# EAGLE schematic cpu-68010 (EAGLE 9.2.1)

## Sheet 1 of 6: External bus connection, power
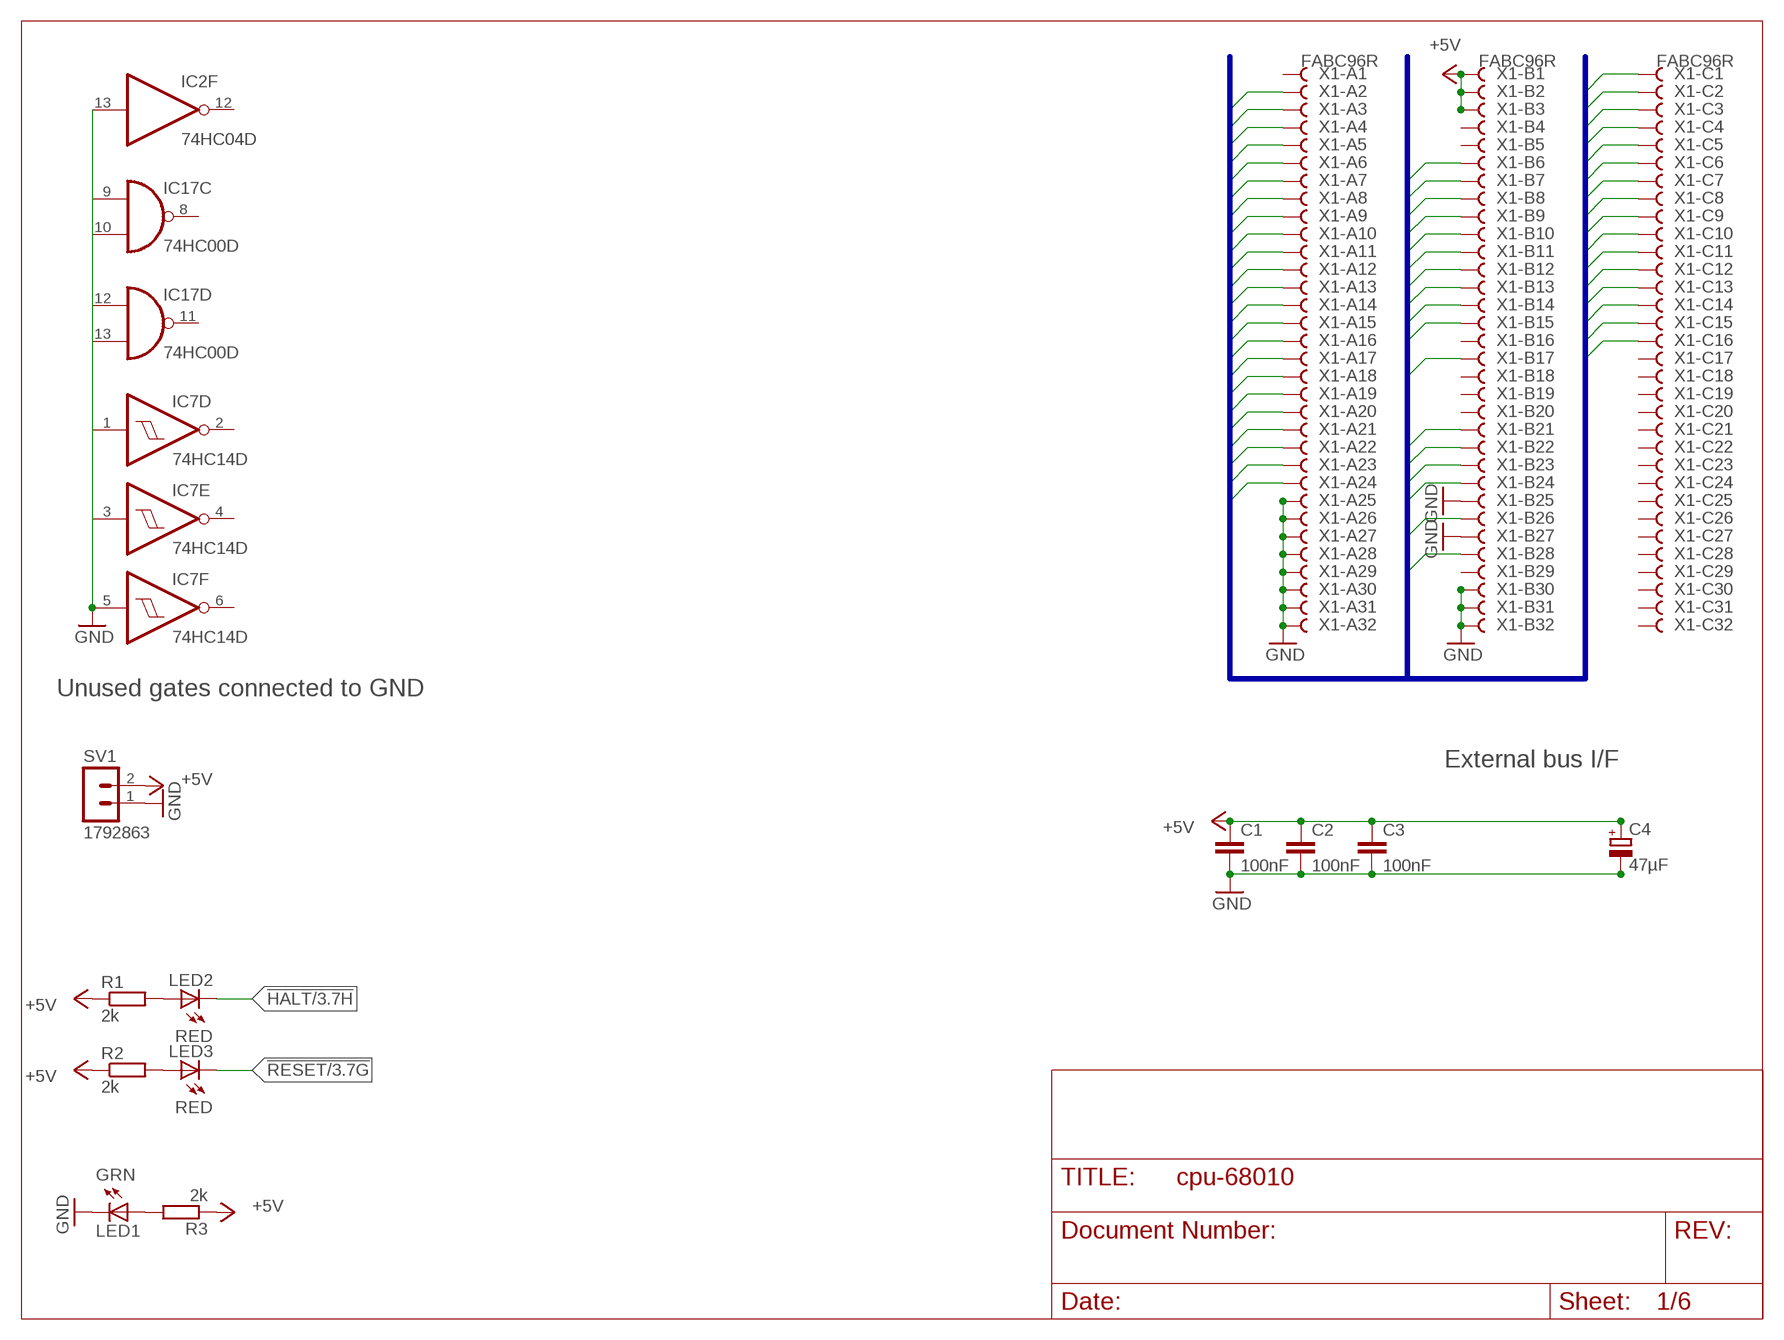
[diagram p0: schematic, sheet 1]

### Parts
C1  100nF  C-EUC0805  [C0805]
C2  100nF  C-EUC0805  [C0805]
C3  100nF  C-EUC0805  [C0805]
C4  47µF  CPOL-EUCT6032  [CT6032]
IC2  74HC04D  [SO14]
IC7  74HC14D  [SO14]
IC17  74HC00D  [SO14]
LED1  GRN  LEDCHIPLED_1206  [CHIPLED_1206]
LED2  RED  LEDCHIPLED_1206  [CHIPLED_1206]
LED3  RED  LEDCHIPLED_1206  [CHIPLED_1206]
R1  2k  R-EU_M0805  [M0805]
R2  2k  R-EU_M0805  [M0805]
R3  2k  R-EU_M0805  [M0805]
SV1  1792863  [1792863]
X1  FABC96R  [FABC96R]

### Nets
!AS: X1.B21 ; also sheet 2
!BERR: X1.B9 ; also sheet 2
!BG: X1.B14 ; also sheet 2
!BGACK: X1.B15 ; also sheet 2
!BR: X1.B13 ; also sheet 2
!EXT_DTACK: X1.B28 ; also sheet 3
!EXT_IRQ: X1.B17 ; also sheet 3
!HALT: LED2.C X1.B11 ; also sheet 2,3
!LDS: X1.B24 ; also sheet 2
!RESET: LED3.C X1.B10 ; also sheet 2,3,6
!UDS: X1.B23 ; also sheet 2
!VPA: X1.B12 ; also sheet 2,3
+5V: C1.1 C2.1 C3.1 C4.+ R1.1 R2.1 R3.1 SV1.2 X1.B1 X1.B2 X1.B3 ; also sheet 2,3,4,5,6
A1: X1.A2 ; also sheet 2,4,5,6
A2: X1.A3 ; also sheet 2,4,5,6
A3: X1.A4 ; also sheet 2,4,5,6
A4: X1.A5 ; also sheet 2,4,5,6
A5: X1.A6 ; also sheet 2,4,5,6
A6: X1.A7 ; also sheet 2,4,5,6
A7: X1.A8 ; also sheet 2,4,5,6
A8: X1.A9 ; also sheet 2,4,5,6
A9: X1.A10 ; also sheet 2,4,5,6
A10: X1.A11 ; also sheet 2,4,5,6
A11: X1.A12 ; also sheet 2,4,5,6
A12: X1.A13 ; also sheet 2,4,5,6
A13: X1.A14 ; also sheet 2,4,5,6
A14: X1.A15 ; also sheet 2,4,5,6
A15: X1.A16 ; also sheet 2,4,5,6
A16: X1.A17 ; also sheet 2,3,4,5
A17: X1.A18 ; also sheet 2,3,4,5
A18: X1.A19 ; also sheet 2,3,4,5
A19: X1.A20 ; also sheet 2,3,5,6
A20: X1.A21 ; also sheet 2
A21: X1.A22 ; also sheet 2
A22: X1.A23 ; also sheet 2
A23: X1.A24 ; also sheet 2
CLK: X1.B26 ; also sheet 2
D0: X1.C1 ; also sheet 2,4,5,6
D1: X1.C2 ; also sheet 2,4,5,6
D2: X1.C3 ; also sheet 2,4,5,6
D3: X1.C4 ; also sheet 2,4,5,6
D4: X1.C5 ; also sheet 2,4,5,6
D5: X1.C6 ; also sheet 2,4,5,6
D6: X1.C7 ; also sheet 2,4,5,6
D7: X1.C8 ; also sheet 2,4,5,6
D8: X1.C9 ; also sheet 2,4,5
D9: X1.C10 ; also sheet 2,4,5
D10: X1.C11 ; also sheet 2,4,5
D11: X1.C12 ; also sheet 2,4,5
D12: X1.C13 ; also sheet 2,4,5
D13: X1.C14 ; also sheet 2,4,5
D14: X1.C15 ; also sheet 2,4,5
D15: X1.C16 ; also sheet 2,4,5
FC0: X1.B6 ; also sheet 2,3
FC1: X1.B7 ; also sheet 2,3
FC2: X1.B8 ; also sheet 2,3
GND: C1.2 C2.2 C3.2 C4.- IC2.13(F:I) IC7.5(F:I) LED1.C SV1.1 X1.A25 X1.A26 X1.A27 X1.A28 X1.A29 X1.A30 X1.A31 X1.A32 X1.B25 X1.B27 X1.B30 X1.B31 X1.B32 ; also sheet 2,3,4,5,6
N$12: LED3.A R2.2
N$15: LED2.A R1.2
N$19: LED1.A R3.2
R!W!: X1.B22 ; also sheet 2
Unconnected: IC2.12(F:O) IC7.1(D:I) IC7.2(D:O) IC7.3(E:I) IC7.4(E:O) IC7.6(F:O) IC17.8(C:O) IC17.9(C:I0) IC17.10(C:I1) IC17.11(D:O) IC17.12(D:I0) IC17.13(D:I1) X1.A1 X1.B4 X1.B5 X1.B16 X1.B18 X1.B19 X1.B20 X1.B29 X1.C17 X1.C18 X1.C19 X1.C20 X1.C21 X1.C22 X1.C23 X1.C24 X1.C25 X1.C26 X1.C27 X1.C28 X1.C29 X1.C30 X1.C31 X1.C32

### Buses
A[1..23],!AS,!BERR,!BG,!BGACK,!BR,CLK,D[0..15],E,!EXT_DTACK,!EXT_IRQ,FC[0..2],!HALT,!IPL[0..2],!LDS,R!W!,!UDS,!VMA,!VPA

### Notes on the sheet
- Unused gates connected to GND
- External bus I/F

## Sheet 2 of 6: CPU, address decoding
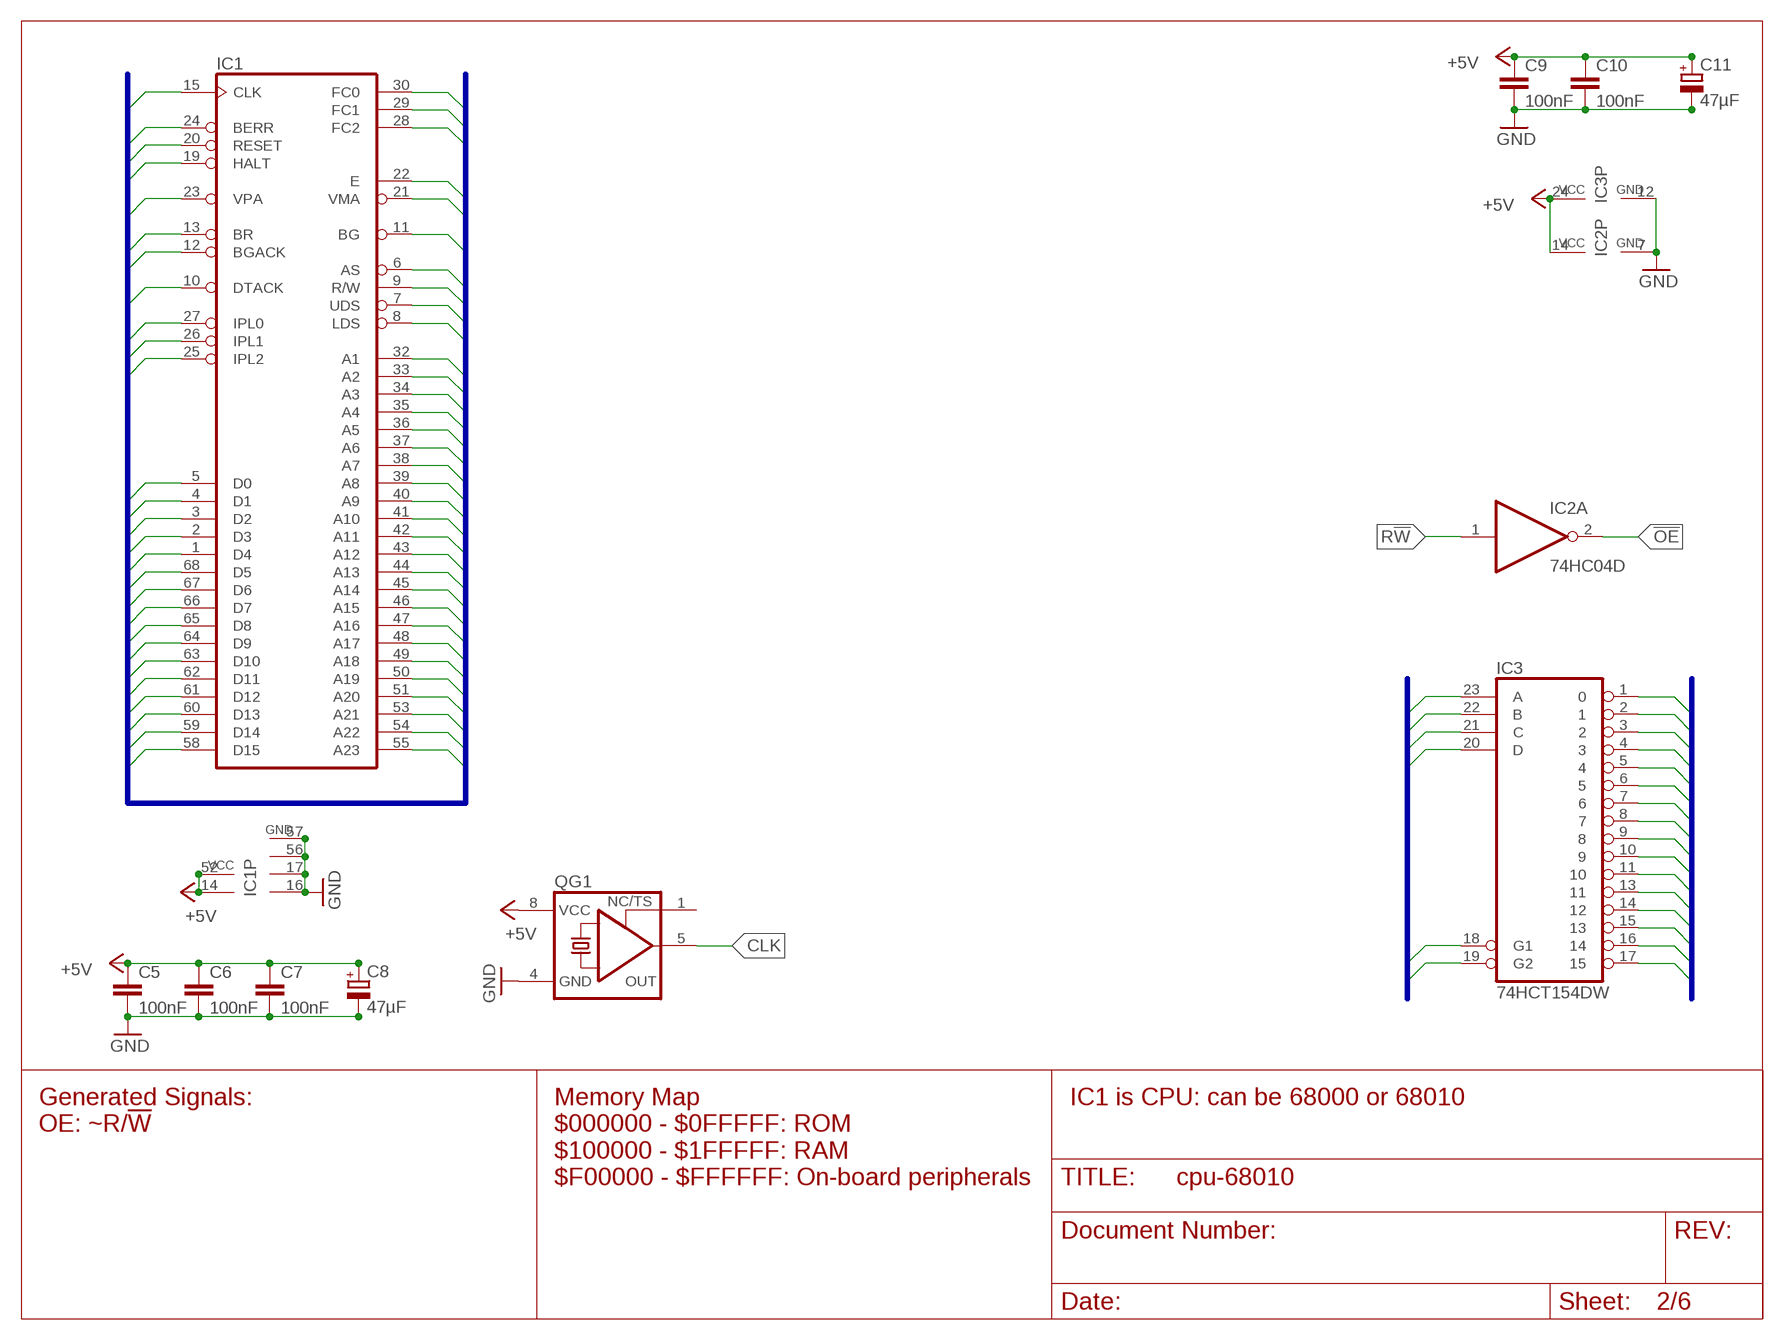
[diagram p1: schematic, sheet 2]

### Parts
C5  100nF  C-EUC0805  [C0805]
C6  100nF  C-EUC0805  [C0805]
C7  100nF  C-EUC0805  [C0805]
C8  47µF  CPOL-EUCT6032  [CT6032]
C9  100nF  C-EUC0805  [C0805]
C10  100nF  C-EUC0805  [C0805]
C11  47µF  CPOL-EUCT6032  [CT6032]
IC1  MC68000FN-SOC  [PLCC68SOCK]
IC3  74HCT154DW  [SO24W]
QG1  XO-8  [DIL08S]

### Nets
!AS: IC1.6(AS) ; also sheet 1
!BERR: IC1.24(BERR) ; also sheet 1
!BG: IC1.11(BG) ; also sheet 1
!BGACK: IC1.12(BGACK) ; also sheet 1
!BR: IC1.13(BR) ; also sheet 1
!DTACK: IC1.10(DTACK) ; also sheet 3
!HALT: IC1.19(HALT) ; also sheet 1,3
!IPL0: IC1.27(IPL0) ; also sheet 3
!IPL1: IC1.26(IPL1) ; also sheet 3
!IPL2: IC1.25(IPL2) ; also sheet 3
!LDS: IC1.8(LDS) ; also sheet 1
!OE: IC2.2(A:O) ; also sheet 4,5,6
!REGION0: IC3.1 ; also sheet 3,5
!REGION1: IC3.2 ; also sheet 3,4
!REGION2: IC3.3
!REGION3: IC3.4
!REGION4: IC3.5
!REGION5: IC3.6
!REGION6: IC3.7
!REGION7: IC3.8
!REGION8: IC3.9
!REGION9: IC3.10
!REGION10: IC3.11
!REGION11: IC3.13
!REGION12: IC3.14
!REGION13: IC3.15
!REGION14: IC3.16
!REGION15: IC3.17 ; also sheet 6
!RESET: IC1.20(RESET) ; also sheet 1,3,6
!UDS: IC1.7(UDS) ; also sheet 1
!VMA: IC1.21(VMA)
!VPA: IC1.23(VPA) ; also sheet 1,3
+5V: C5.1 C6.1 C7.1 C8.+ C9.1 C10.1 C11.+ IC1.14(VCC) IC1.52(VCC) IC2.14(P:VCC) IC3.24(VCC) QG1.8(VCC) ; also sheet 1,3,4,5,6
/AS: IC3.18(G1) IC3.19(G2)
A1: IC1.32(A1) ; also sheet 1,4,5,6
A2: IC1.33(A2) ; also sheet 1,4,5,6
A3: IC1.34(A3) ; also sheet 1,4,5,6
A4: IC1.35(A4) ; also sheet 1,4,5,6
A5: IC1.36(A5) ; also sheet 1,4,5,6
A6: IC1.37(A6) ; also sheet 1,4,5,6
A7: IC1.38(A7) ; also sheet 1,4,5,6
A8: IC1.39(A8) ; also sheet 1,4,5,6
A9: IC1.40(A9) ; also sheet 1,4,5,6
A10: IC1.41(A10) ; also sheet 1,4,5,6
A11: IC1.42(A11) ; also sheet 1,4,5,6
A12: IC1.43(A12) ; also sheet 1,4,5,6
A13: IC1.44(A13) ; also sheet 1,4,5,6
A14: IC1.45(A14) ; also sheet 1,4,5,6
A15: IC1.46(A15) ; also sheet 1,4,5,6
A16: IC1.47(A16) ; also sheet 1,3,4,5
A17: IC1.48(A17) ; also sheet 1,3,4,5
A18: IC1.49(A18) ; also sheet 1,3,4,5
A19: IC1.50(A19) ; also sheet 1,3,5,6
A20: IC1.51(A20) IC3.23(A) ; also sheet 1
A21: IC1.53(A21) IC3.22(B) ; also sheet 1
A22: IC1.54(A22) IC3.21(C) ; also sheet 1
A23: IC1.55(A23) IC3.20(D) ; also sheet 1
CLK: IC1.15(CLK) QG1.5(OUT) ; also sheet 1
D0: IC1.5(D0) ; also sheet 1,4,5,6
D1: IC1.4(D1) ; also sheet 1,4,5,6
D2: IC1.3(D2) ; also sheet 1,4,5,6
D3: IC1.2(D3) ; also sheet 1,4,5,6
D4: IC1.1(D4) ; also sheet 1,4,5,6
D5: IC1.68(D5) ; also sheet 1,4,5,6
D6: IC1.67(D6) ; also sheet 1,4,5,6
D7: IC1.66(D7) ; also sheet 1,4,5,6
D8: IC1.65(D8) ; also sheet 1,4,5
D9: IC1.64(D9) ; also sheet 1,4,5
D10: IC1.63(D10) ; also sheet 1,4,5
D11: IC1.62(D11) ; also sheet 1,4,5
D12: IC1.61(D12) ; also sheet 1,4,5
D13: IC1.60(D13) ; also sheet 1,4,5
D14: IC1.59(D14) ; also sheet 1,4,5
D15: IC1.58(D15) ; also sheet 1,4,5
E: IC1.22(E)
FC0: IC1.30(FC0) ; also sheet 1,3
FC1: IC1.29(FC1) ; also sheet 1,3
FC2: IC1.28(FC2) ; also sheet 1,3
GND: C5.2 C6.2 C7.2 C8.- C9.2 C10.2 C11.- IC1.16(GND) IC1.17(GND) IC1.56(GND) IC1.57(GND) IC2.7(P:GND) IC3.12(GND) QG1.4(GND) ; also sheet 1,3,4,5,6
R!W!: IC1.9(R/W) IC2.1(A:I) ; also sheet 1
Unconnected: QG1.1(TS)

### Buses
A[1..23],!AS,!BERR,!BG,!BGACK,!BR,CLK,D[0..15],!DTACK,E,FC[0..2],!HALT,!IPL[0..2],!LDS,R!W!,!UDS,!VMA,!VPA
A[20..23],/AS
!REGION[0..15]

### Notes on the sheet
- Generated Signals:
  OE: ~R/!W
- Memory Map
  $000000 - $0FFFFF: ROM
  $100000 - $1FFFFF: RAM
  $F00000 - $FFFFFF: On-board peripherals
- IC1 is CPU: can be 68000 or 68010

## Sheet 3 of 6: DTACK and Interrupts
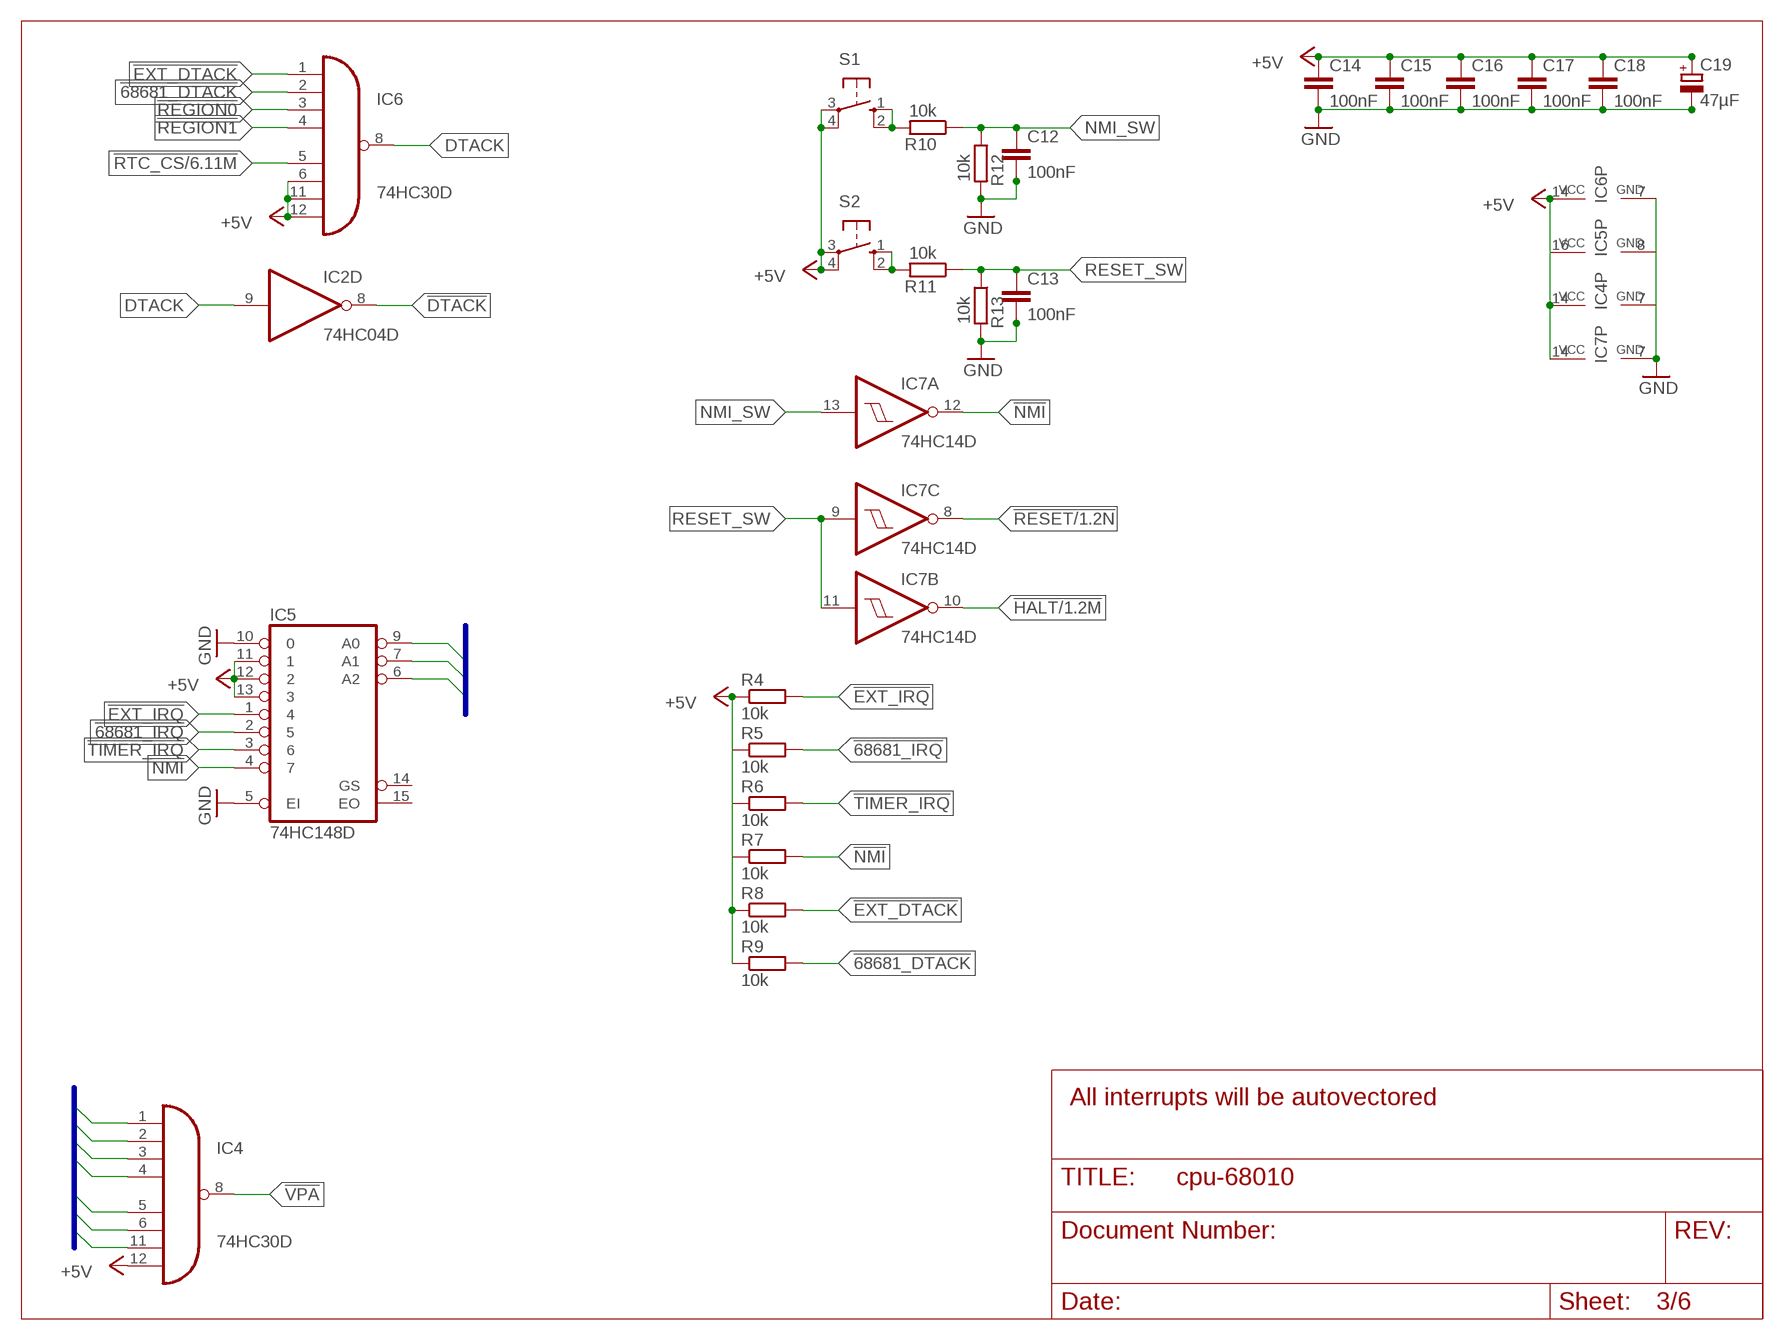
[diagram p2: schematic, sheet 3]

### Parts
C12  100nF  C-EUC0805  [C0805]
C13  100nF  C-EUC0805  [C0805]
C14  100nF  C-EUC0805  [C0805]
C15  100nF  C-EUC0805  [C0805]
C16  100nF  C-EUC0805  [C0805]
C17  100nF  C-EUC0805  [C0805]
C18  100nF  C-EUC0805  [C0805]
C19  47µF  CPOL-EUCT6032  [CT6032]
IC4  74HC30D  [SO14]
IC5  74HC148D  [SO16]
IC6  74HC30D  [SO14]
R4  10k  R-EU_M0805  [M0805]
R5  10k  R-EU_M0805  [M0805]
R6  10k  R-EU_M0805  [M0805]
R7  10k  R-EU_M0805  [M0805]
R8  10k  R-EU_M0805  [M0805]
R9  10k  R-EU_M0805  [M0805]
R10  10k  R-EU_M0805  [M0805]
R11  10k  R-EU_M0805  [M0805]
R12  10k  R-EU_M0805  [M0805]
R13  10k  R-EU_M0805  [M0805]
S1  10-XX  [B3F-10XX]
S2  10-XX  [B3F-10XX]

### Nets
!68681_DTACK: IC6.2(I1) R9.2 ; also sheet 6
!68681_IRQ: IC5.2 R5.2 ; also sheet 6
!DTACK: IC2.8(D:O) ; also sheet 2
!EXT_DTACK: IC6.1(I0) R8.2 ; also sheet 1
!EXT_IRQ: IC5.1 R4.2 ; also sheet 1
!HALT: IC7.10(B:O) ; also sheet 1,2
!IPL0: IC5.9(A0) ; also sheet 2
!IPL1: IC5.7(A1) ; also sheet 2
!IPL2: IC5.6(A2) ; also sheet 2
!NMI: IC5.4 IC7.12(A:O) R7.2
!REGION0: IC6.3(I2) ; also sheet 2,5
!REGION1: IC6.4(I3) ; also sheet 2,4
!RESET: IC7.8(C:O) ; also sheet 1,2,6
!RTC_CS: IC6.5(I4) ; also sheet 6
!TIMER_IRQ: IC5.3 R6.2
!VPA: IC4.8(O) ; also sheet 1,2
+5V: C14.1 C15.1 C16.1 C17.1 C18.1 C19.+ IC4.12(I7) IC4.14(VCC) IC5.11 IC5.12 IC5.13 IC5.16(VCC) IC6.6(I5) IC6.11(I6) IC6.12(I7) IC6.14(VCC) IC7.14(P:VCC) R4.1 R8.1 R9.1 S1.3(P) S1.4(P1) S2.3(P) S2.4(P1) ; also sheet 1,2,4,5,6
A16: IC4.4(I3) ; also sheet 1,2,4,5
A17: IC4.5(I4) ; also sheet 1,2,4,5
A18: IC4.6(I5) ; also sheet 1,2,4,5
A19: IC4.11(I6) ; also sheet 1,2,5,6
DTACK: IC2.9(D:I) IC6.8(O)
FC0: IC4.1(I0) ; also sheet 1,2
FC1: IC4.2(I1) ; also sheet 1,2
FC2: IC4.3(I2) ; also sheet 1,2
GND: C12.2 C13.2 C14.2 C15.2 C16.2 C17.2 C18.2 C19.- IC4.7(GND) IC5.5(EI) IC5.8(GND) IC5.10 IC6.7(GND) IC7.7(P:GND) R12.2 R13.2 ; also sheet 1,2,4,5,6
N$9: R11.2 S2.1(S) S2.2(S1)
N$18: R10.2 S1.1(S) S1.2(S1)
NMI_SW: C12.1 IC7.13(A:I) R10.1 R12.1
RESET_SW: C13.1 IC7.9(C:I) IC7.11(B:I) R11.1 R13.1
Unconnected: IC5.14(GS) IC5.15(EO) R5.1 R6.1 R7.1

### Buses
!IPL[0..2]
A[16..19],FC[0..2]

### Notes on the sheet
- All interrupts will be autovectored

## Sheet 4 of 6: Internal RAM
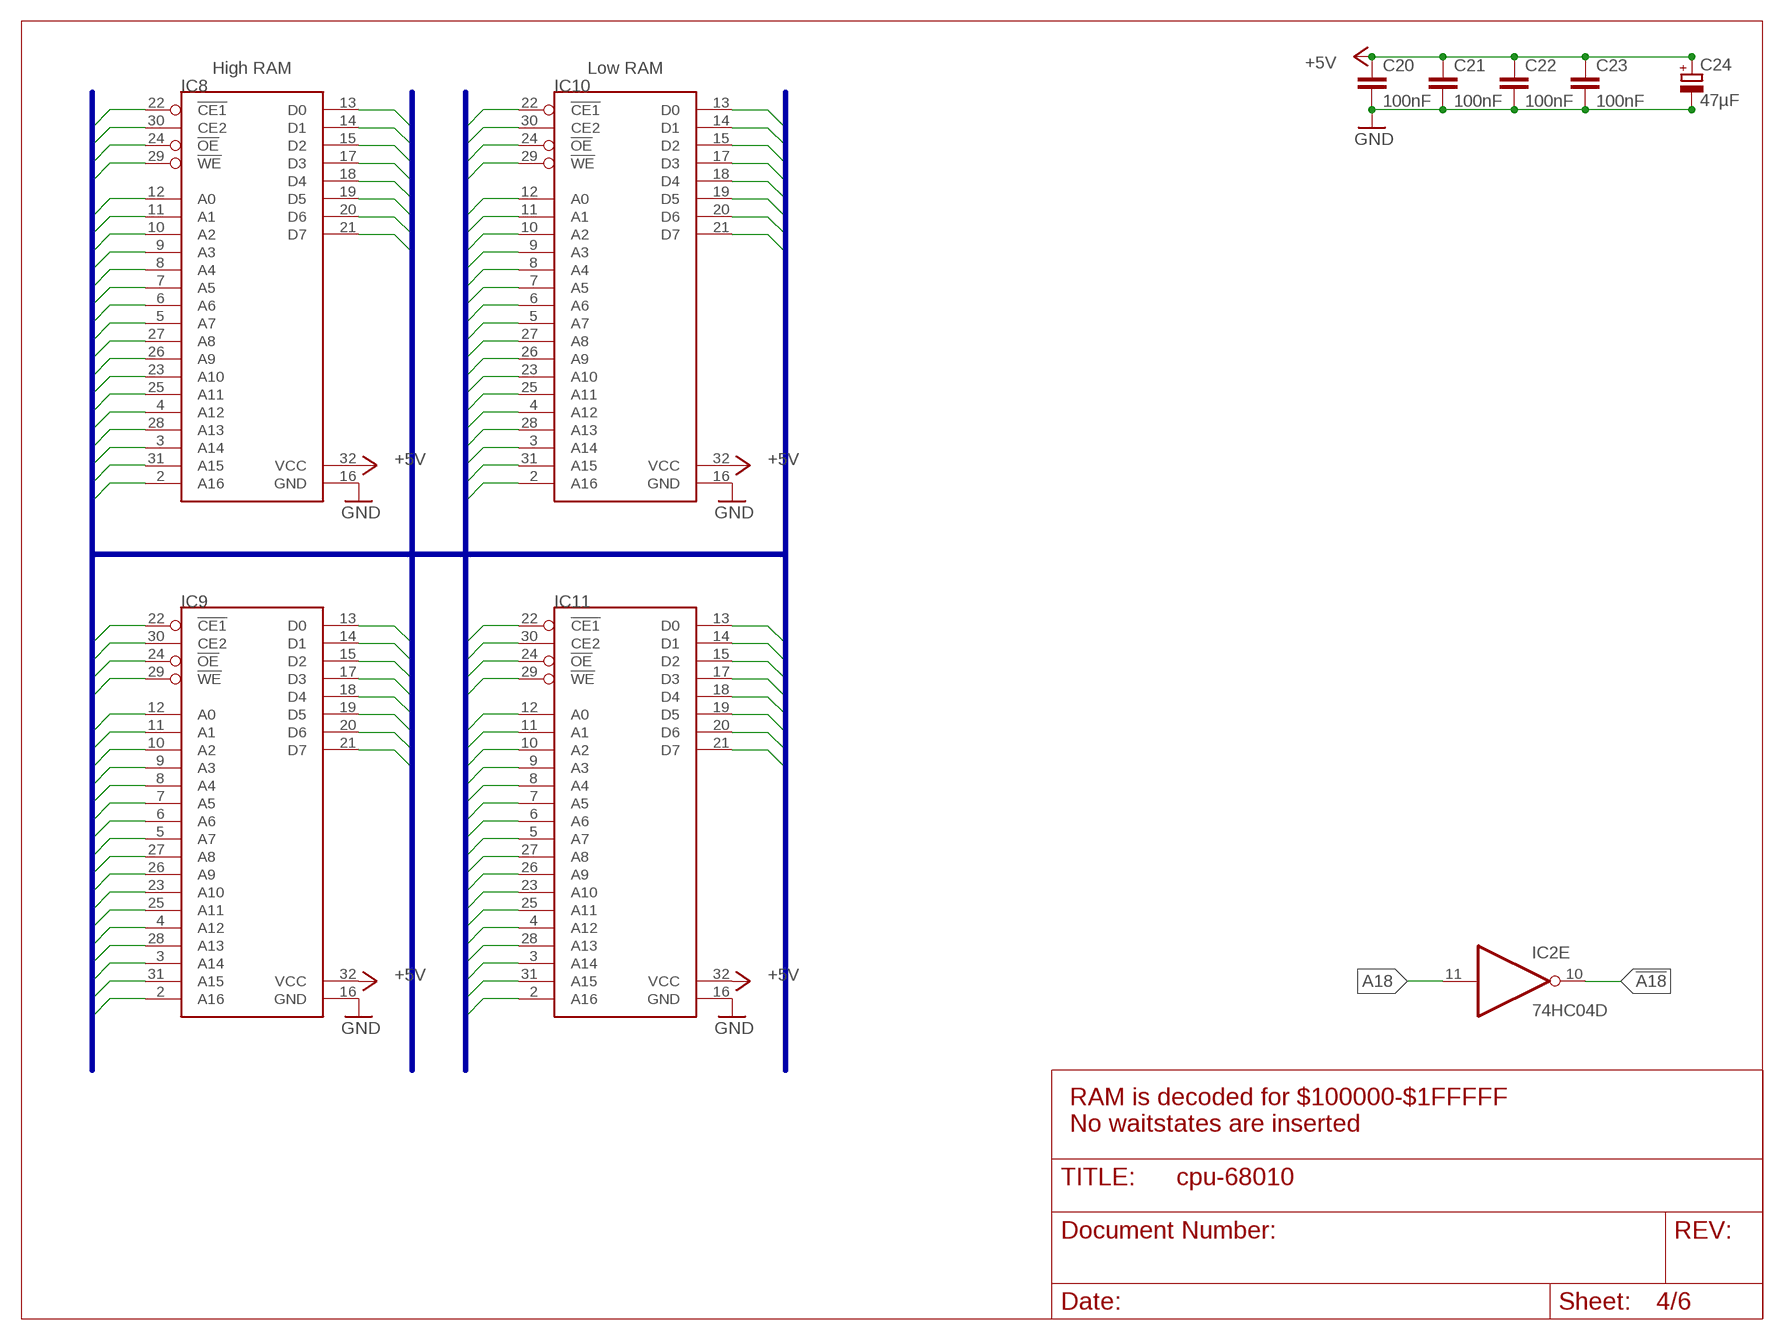
[diagram p3: schematic, sheet 4]

### Parts
C20  100nF  C-EUC0805  [C0805]
C21  100nF  C-EUC0805  [C0805]
C22  100nF  C-EUC0805  [C0805]
C23  100nF  C-EUC0805  [C0805]
C24  47µF  CPOL-EUCT6032  [CT6032]
IC8  CY62128BSOIC32  [SO32X]
IC9  CY62128BSOIC32  [SO32X]
IC10  CY62128BSOIC32  [SO32X]
IC11  CY62128BSOIC32  [SO32X]

### Nets
!A18: IC2.10(E:O) IC8.30(CE2) IC9.30(CE2) IC10.30(CE2) IC11.30(CE2)
!OE: IC8.24(!OE) IC9.24(!OE) IC10.24(!OE) IC11.24(!OE) ; also sheet 2,5,6
!REGION1: IC8.22(!CE1) IC9.22(!CE1) IC10.22(!CE1) IC11.22(!CE1) ; also sheet 2,3
+5V: C20.1 C21.1 C22.1 C23.1 C24.+ IC8.32(VCC) IC9.32(VCC) IC10.32(VCC) IC11.32(VCC) ; also sheet 1,2,3,5,6
A1: IC8.12(A0) IC9.12(A0) IC10.12(A0) IC11.12(A0) ; also sheet 1,2,5,6
A2: IC8.11(A1) IC9.11(A1) IC10.11(A1) IC11.11(A1) ; also sheet 1,2,5,6
A3: IC8.10(A2) IC9.10(A2) IC10.10(A2) IC11.10(A2) ; also sheet 1,2,5,6
A4: IC8.9(A3) IC9.9(A3) IC10.9(A3) IC11.9(A3) ; also sheet 1,2,5,6
A5: IC8.8(A4) IC9.8(A4) IC10.8(A4) IC11.8(A4) ; also sheet 1,2,5,6
A6: IC8.7(A5) IC9.7(A5) IC10.7(A5) IC11.7(A5) ; also sheet 1,2,5,6
A7: IC8.6(A6) IC9.6(A6) IC10.6(A6) IC11.6(A6) ; also sheet 1,2,5,6
A8: IC8.5(A7) IC9.5(A7) IC10.5(A7) IC11.5(A7) ; also sheet 1,2,5,6
A9: IC8.27(A8) IC9.27(A8) IC10.27(A8) IC11.27(A8) ; also sheet 1,2,5,6
A10: IC8.26(A9) IC9.26(A9) IC10.26(A9) IC11.26(A9) ; also sheet 1,2,5,6
A11: IC8.23(A10) IC9.23(A10) IC10.23(A10) IC11.23(A10) ; also sheet 1,2,5,6
A12: IC8.25(A11) IC9.25(A11) IC10.25(A11) IC11.25(A11) ; also sheet 1,2,5,6
A13: IC8.4(A12) IC9.4(A12) IC10.4(A12) IC11.4(A12) ; also sheet 1,2,5,6
A14: IC8.28(A13) IC9.28(A13) IC10.28(A13) IC11.28(A13) ; also sheet 1,2,5,6
A15: IC8.3(A14) IC9.3(A14) IC10.3(A14) IC11.3(A14) ; also sheet 1,2,5,6
A16: IC8.31(A15) IC9.31(A15) IC10.31(A15) IC11.31(A15) ; also sheet 1,2,3,5
A17: IC8.2(A16) IC9.2(A16) IC10.2(A16) IC11.2(A16) ; also sheet 1,2,3,5
A18: IC2.11(E:I) ; also sheet 1,2,3,5
D0: IC10.13(D0) IC11.13(D0) ; also sheet 1,2,5,6
D1: IC10.14(D1) IC11.14(D1) ; also sheet 1,2,5,6
D2: IC10.15(D2) IC11.15(D2) ; also sheet 1,2,5,6
D3: IC10.17(D3) IC11.17(D3) ; also sheet 1,2,5,6
D4: IC10.18(D4) IC11.18(D4) ; also sheet 1,2,5,6
D5: IC10.19(D5) IC11.19(D5) ; also sheet 1,2,5,6
D6: IC10.20(D6) IC11.20(D6) ; also sheet 1,2,5,6
D7: IC10.21(D7) IC11.21(D7) ; also sheet 1,2,5,6
D8: IC8.13(D0) IC9.13(D0) ; also sheet 1,2,5
D9: IC8.14(D1) IC9.14(D1) ; also sheet 1,2,5
D10: IC8.15(D2) IC9.15(D2) ; also sheet 1,2,5
D11: IC8.17(D3) IC9.17(D3) ; also sheet 1,2,5
D12: IC8.18(D4) IC9.18(D4) ; also sheet 1,2,5
D13: IC8.19(D5) IC9.19(D5) ; also sheet 1,2,5
D14: IC8.20(D6) IC9.20(D6) ; also sheet 1,2,5
D15: IC8.21(D7) IC9.21(D7) ; also sheet 1,2,5
GND: C20.2 C21.2 C22.2 C23.2 C24.- IC8.16(GND) IC9.16(GND) IC10.16(GND) IC11.16(GND) ; also sheet 1,2,3,5,6
R/!W!: IC8.29(!WE) IC9.29(!WE) IC10.29(!WE) IC11.29(!WE) ; also sheet 5,6

### Buses
A[1..23],!A18,D[0..15],!OE,!REGION1,R/!W!

### Notes on the sheet
- High RAM | Low RAM
- RAM is decoded for $100000-$1FFFFF
  No waitstates are inserted

## Sheet 5 of 6: System ROMs
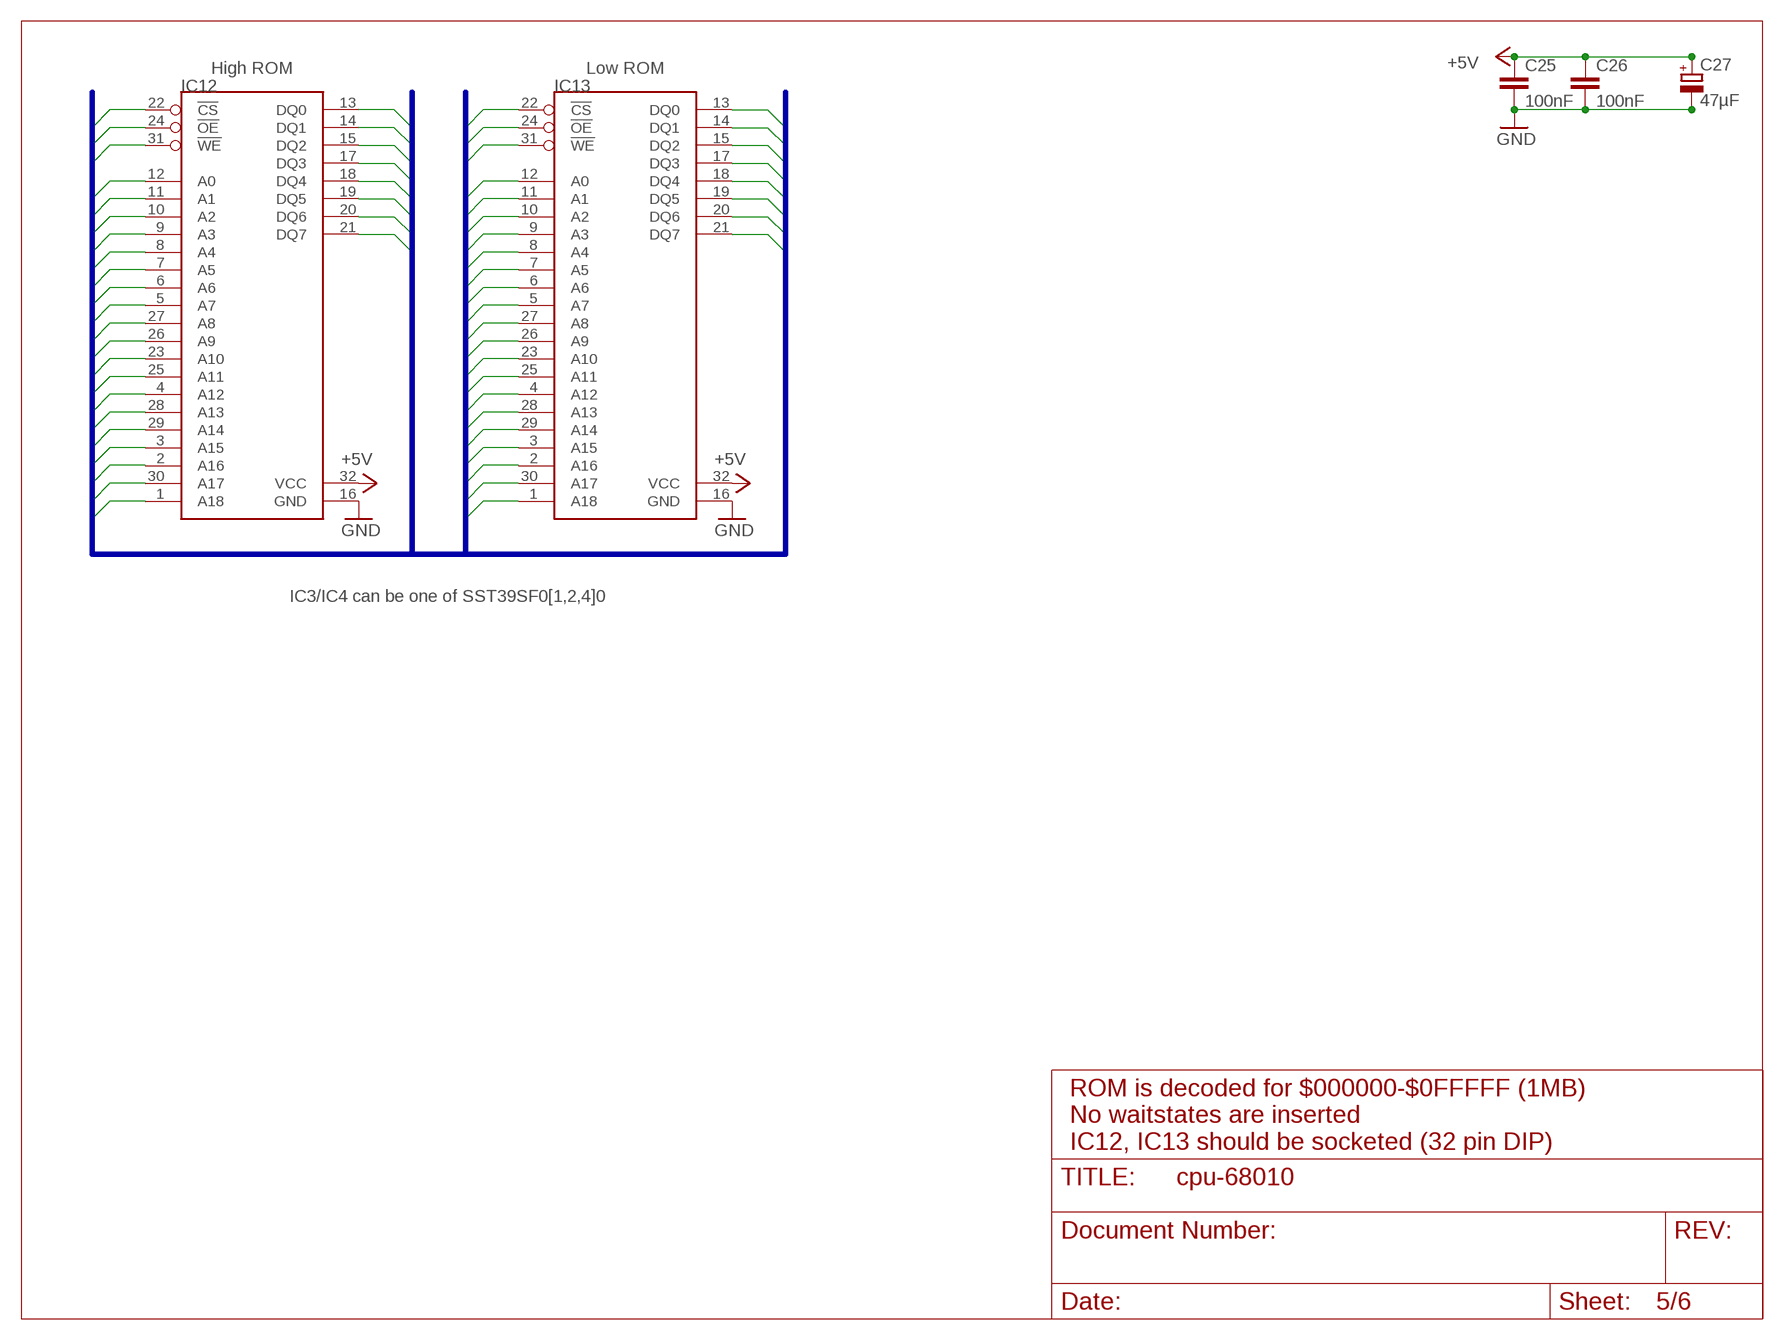
[diagram p4: schematic, sheet 5]

### Parts
C25  100nF  C-EUC0805  [C0805]
C26  100nF  C-EUC0805  [C0805]
C27  47µF  CPOL-EUCT6032  [CT6032]
IC12  SST39SF0X0PDIP32  [DIL32]
IC13  SST39SF0X0PDIP32  [DIL32]

### Nets
!OE: IC12.24(!OE) IC13.24(!OE) ; also sheet 2,4,6
!REGION0: IC12.22(!CS) IC13.22(!CS) ; also sheet 2,3
+5V: C25.1 C26.1 C27.+ IC12.32(VCC) IC13.32(VCC) ; also sheet 1,2,3,4,6
A1: IC12.12(A0) IC13.12(A0) ; also sheet 1,2,4,6
A2: IC12.11(A1) IC13.11(A1) ; also sheet 1,2,4,6
A3: IC12.10(A2) IC13.10(A2) ; also sheet 1,2,4,6
A4: IC12.9(A3) IC13.9(A3) ; also sheet 1,2,4,6
A5: IC12.8(A4) IC13.8(A4) ; also sheet 1,2,4,6
A6: IC12.7(A5) IC13.7(A5) ; also sheet 1,2,4,6
A7: IC12.6(A6) IC13.6(A6) ; also sheet 1,2,4,6
A8: IC12.5(A7) IC13.5(A7) ; also sheet 1,2,4,6
A9: IC12.27(A8) IC13.27(A8) ; also sheet 1,2,4,6
A10: IC12.26(A9) IC13.26(A9) ; also sheet 1,2,4,6
A11: IC12.23(A10) IC13.23(A10) ; also sheet 1,2,4,6
A12: IC12.25(A11) IC13.25(A11) ; also sheet 1,2,4,6
A13: IC12.4(A12) IC13.4(A12) ; also sheet 1,2,4,6
A14: IC12.28(A13) IC13.28(A13) ; also sheet 1,2,4,6
A15: IC12.29(A14) IC13.29(A14) ; also sheet 1,2,4,6
A16: IC12.3(A15) IC13.3(A15) ; also sheet 1,2,3,4
A17: IC12.2(A16) IC13.2(A16) ; also sheet 1,2,3,4
A18: IC12.30(A17) IC13.30(A17) ; also sheet 1,2,3,4
A19: IC12.1(A18) IC13.1(A18) ; also sheet 1,2,3,6
D0: IC13.13(DQ0) ; also sheet 1,2,4,6
D1: IC13.14(DQ1) ; also sheet 1,2,4,6
D2: IC13.15(DQ2) ; also sheet 1,2,4,6
D3: IC13.17(DQ3) ; also sheet 1,2,4,6
D4: IC13.18(DQ4) ; also sheet 1,2,4,6
D5: IC13.19(DQ5) ; also sheet 1,2,4,6
D6: IC13.20(DQ6) ; also sheet 1,2,4,6
D7: IC13.21(DQ7) ; also sheet 1,2,4,6
D8: IC12.13(DQ0) ; also sheet 1,2,4
D9: IC12.14(DQ1) ; also sheet 1,2,4
D10: IC12.15(DQ2) ; also sheet 1,2,4
D11: IC12.17(DQ3) ; also sheet 1,2,4
D12: IC12.18(DQ4) ; also sheet 1,2,4
D13: IC12.19(DQ5) ; also sheet 1,2,4
D14: IC12.20(DQ6) ; also sheet 1,2,4
D15: IC12.21(DQ7) ; also sheet 1,2,4
GND: C25.2 C26.2 C27.- IC12.16(GND) IC13.16(GND) ; also sheet 1,2,3,4,6
R/!W!: IC12.31(!WE) IC13.31(!WE) ; also sheet 4,6

### Buses
A[1..23],D[0..15],!OE,!REGION0,R/!W!

### Notes on the sheet
- High ROM | Low ROM
- IC3/IC4 can be one of SST39SF0[1,2,4]0
- ROM is decoded for $000000-$0FFFFF (1MB)
  No waitstates are inserted
  IC12, IC13 should be socketed (32 pin DIP)

## Sheet 6 of 6: Peripherals
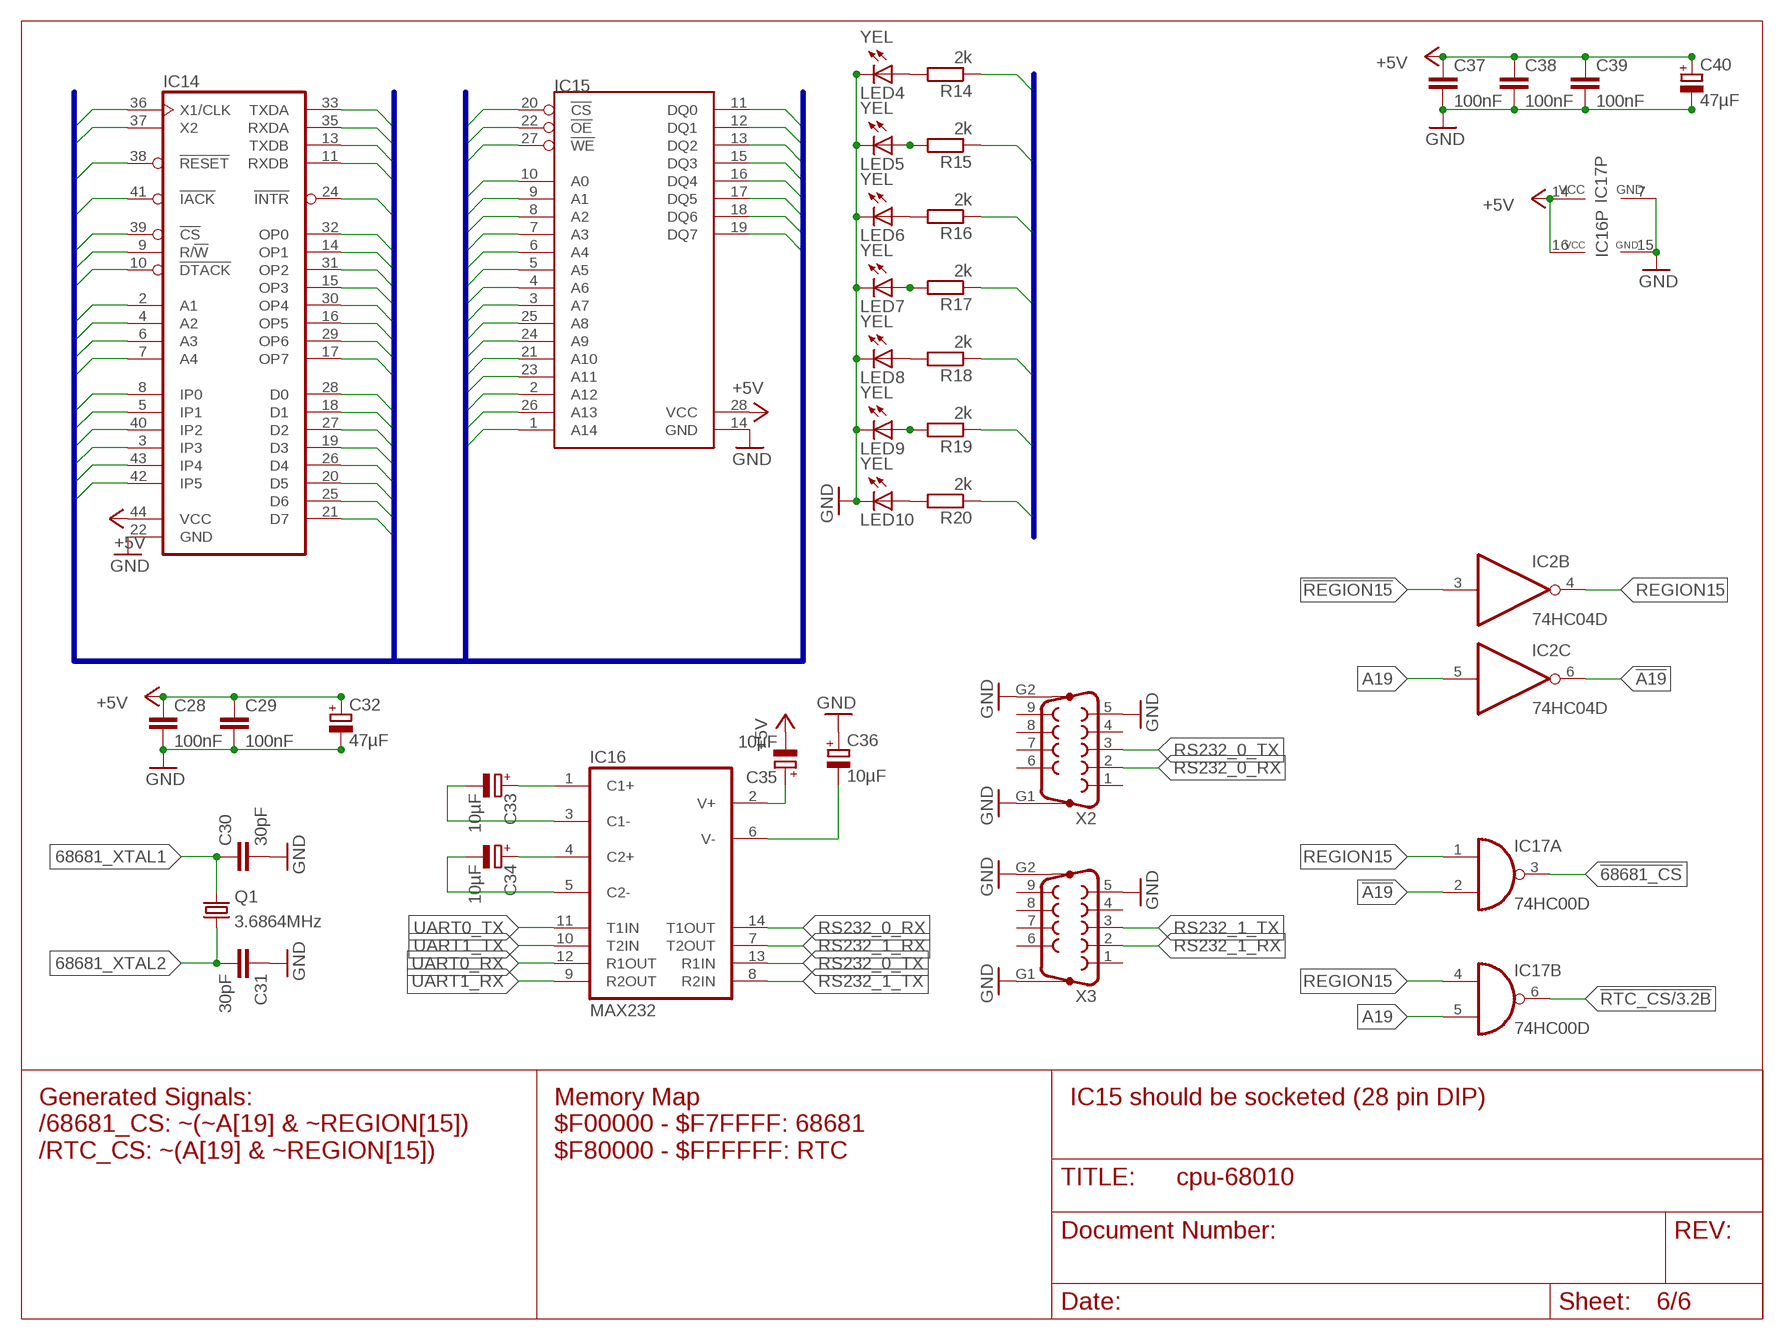
[diagram p5: schematic, sheet 6]

### Parts
C28  100nF  C-EUC0805  [C0805]
C29  100nF  C-EUC0805  [C0805]
C30  30pF  C-EUC0805  [C0805]
C31  30pF  C-EUC0805  [C0805]
C32  47µF  CPOL-EUCT6032  [CT6032]
C33  10µF  CPOL-EUE1.8-4  [E1,8-4]
C34  10µF  CPOL-EUE1.8-4  [E1,8-4]
C35  10µF  CPOL-EUE1.8-4  [E1,8-4]
C36  10µF  CPOL-EUE1.8-4  [E1,8-4]
C37  100nF  C-EUC0805  [C0805]
C38  100nF  C-EUC0805  [C0805]
C39  100nF  C-EUC0805  [C0805]
C40  47µF  CPOL-EUCT6032  [CT6032]
IC14  MC68681PLCC44-SOCKET  [PLCC-S44]
IC15  DS1244EDIP-28  [DIL28-6]
IC16  MAX232  [DIL16]
LED4  YEL  LEDCHIPLED_1206  [CHIPLED_1206]
LED5  YEL  LEDCHIPLED_1206  [CHIPLED_1206]
LED6  YEL  LEDCHIPLED_1206  [CHIPLED_1206]
LED7  YEL  LEDCHIPLED_1206  [CHIPLED_1206]
LED8  YEL  LEDCHIPLED_1206  [CHIPLED_1206]
LED9  YEL  LEDCHIPLED_1206  [CHIPLED_1206]
LED10  YEL  LEDCHIPLED_1206  [CHIPLED_1206]
Q1  3.6864MHz  CRYSTALHC49S  [HC49/S]
R14  2k  R-EU_M0805  [M0805]
R15  2k  R-EU_M0805  [M0805]
R16  2k  R-EU_M0805  [M0805]
R17  2k  R-EU_M0805  [M0805]
R18  2k  R-EU_M0805  [M0805]
R19  2k  R-EU_M0805  [M0805]
R20  2k  R-EU_M0805  [M0805]
X2  F09HP  [F09HP]
X3  F09HP  [F09HP]

### Nets
68681_XTAL1: C30.1 IC14.36(X1/CLK) Q1.2
68681_XTAL2: C31.2 IC14.37(X2) Q1.1
!68681_CS: IC14.39(!CS) IC17.3(A:O)
!68681_DTACK: IC14.10(!DTACK) ; also sheet 3
!68681_IRQ: IC14.24(!INTR) ; also sheet 3
!68681_IRQACK: IC14.41(!IACK)
!A19: IC2.6(C:O) IC17.2(A:I1)
!OE: IC15.22(!OE) ; also sheet 2,4,5
!REGION15: IC2.3(B:I) ; also sheet 2
!RESET: IC14.38(!RESET) ; also sheet 1,2,3
!RTC_CS: IC15.20(!CS) IC17.6(B:O) ; also sheet 3
+5V: C28.1 C29.1 C32.+ C35.- C37.1 C38.1 C39.1 C40.+ IC14.44(VCC) IC15.28(VCC) IC16.16(VCC) IC17.14(P:VCC) ; also sheet 1,2,3,4,5
A1: IC14.2(A1) IC15.10(A0) ; also sheet 1,2,4,5
A2: IC14.4(A2) IC15.9(A1) ; also sheet 1,2,4,5
A3: IC14.6(A3) IC15.8(A2) ; also sheet 1,2,4,5
A4: IC14.7(A4) IC15.7(A3) ; also sheet 1,2,4,5
A5: IC15.6(A4) ; also sheet 1,2,4,5
A6: IC15.5(A5) ; also sheet 1,2,4,5
A7: IC15.4(A6) ; also sheet 1,2,4,5
A8: IC15.3(A7) ; also sheet 1,2,4,5
A9: IC15.25(A8) ; also sheet 1,2,4,5
A10: IC15.24(A9) ; also sheet 1,2,4,5
A11: IC15.21(A10) ; also sheet 1,2,4,5
A12: IC15.23(A11) ; also sheet 1,2,4,5
A13: IC15.2(A12) ; also sheet 1,2,4,5
A14: IC15.26(A13) ; also sheet 1,2,4,5
A15: IC15.1(A14) ; also sheet 1,2,4,5
A19: IC2.5(C:I) IC17.5(B:I1) ; also sheet 1,2,3,5
D0: IC14.28(D0) IC15.11(DQ0) ; also sheet 1,2,4,5
D1: IC14.18(D1) IC15.12(DQ1) ; also sheet 1,2,4,5
D2: IC14.27(D2) IC15.13(DQ2) ; also sheet 1,2,4,5
D3: IC14.19(D3) IC15.15(DQ3) ; also sheet 1,2,4,5
D4: IC14.26(D4) IC15.16(DQ4) ; also sheet 1,2,4,5
D5: IC14.20(D5) IC15.17(DQ5) ; also sheet 1,2,4,5
D6: IC14.25(D6) IC15.18(DQ6) ; also sheet 1,2,4,5
D7: IC14.21(D7) IC15.19(DQ7) ; also sheet 1,2,4,5
GND: C28.2 C29.2 C30.2 C31.1 C32.- C36.+ C37.2 C38.2 C39.2 C40.- IC14.22(GND) IC15.14(GND) IC16.15(GND) IC17.7(P:GND) LED4.C LED5.C LED6.C LED7.C LED8.C LED9.C LED10.C X2.5 X2.G1 X2.G2 X3.5 X3.G1 X3.G2 ; also sheet 1,2,3,4,5
GPIO_IN0: IC14.8(IP0)
GPIO_IN1: IC14.5(IP1)
GPIO_IN2: IC14.40(IP2)
GPIO_IN3: IC14.3(IP3)
GPIO_IN4: IC14.43(IP4)
GPIO_IN5: IC14.42(IP5)
GPIO_OUT0: IC14.32(OP0) R14.1
GPIO_OUT1: IC14.14(OP1) R15.1
GPIO_OUT2: IC14.15(OP3) R16.1
GPIO_OUT3: IC14.30(OP4) R17.1
GPIO_OUT4: IC14.16(OP5) R18.1
GPIO_OUT5: IC14.29(OP6) R19.1
GPIO_OUT6: IC14.17(OP7) R20.1
N$1: C35.+ IC16.2(V+)
N$2: C36.- IC16.6(V-)
N$3: C33.+ IC16.1(C1+)
N$4: C34.+ IC16.4(C2+)
N$5: C33.- IC16.3(C1-)
N$6: C34.- IC16.5(C2-)
N$7: LED9.A R19.2
N$8: LED8.A R18.2
N$10: LED7.A R17.2
N$11: LED6.A R16.2
N$13: LED5.A R15.2
N$14: LED4.A R14.2
N$17: LED10.A R20.2
R/!W!: IC14.9(R/!W) IC15.27(!WE) ; also sheet 4,5
REGION15: IC2.4(B:O) IC17.1(A:I0) IC17.4(B:I0)
RS232_0_RX: IC16.14(T1OUT) X2.2
RS232_0_TX: IC16.13(R1IN) X2.3
RS232_1_RX: IC16.7(T2OUT) X3.2
RS232_1_TX: IC16.8(R2IN) X3.3
TIMER_CLK: IC14.31(OP2)
UART0_RX: IC14.35(RXDA) IC16.12(R1OUT)
UART0_TX: IC14.33(TXDA) IC16.11(T1IN)
UART1_RX: IC14.11(RXDB) IC16.9(R2OUT)
UART1_TX: IC14.13(TXDB) IC16.10(T2IN)
Unconnected: X2.1 X2.4 X2.6 X2.7 X2.8 X2.9 X3.1 X3.4 X3.6 X3.7 X3.8 X3.9

### Buses
!68681_CS,!68681_DTACK,!68681_IACK,!68681_IRQ,!68681_IRQACK,68681_XTAL[1..2],A[1..23],CLK,D[0..15],GPIO_IN[0..5],GPIO_OUT[0..6],!LDS,!OE,!RESET,!RTC_CS,R!W!,TIMER_CLK,UART0_RX,UART0_TX,UART1_RX,UART1_TX
GPIO_OUT[0..7]

### Notes on the sheet
- Generated Signals:
  /68681_CS: ~(~A[19] & ~REGION[15])
  /RTC_CS: ~(A[19] & ~REGION[15])
- Memory Map
  $F00000 - $F7FFFF: 68681
  $F80000 - $FFFFFF: RTC
- IC15 should be socketed (28 pin DIP)

## Library data of the parts
C1-C3 C5-C7 C9 C10 C12-C18 C20-C23 C25 C26 C28-C31 C37-C39 = rcl:C-EU: CAPACITOR, European symbol; MOUSER: 710-885012207072; SPICEPREFIX: C
C4 C8 C11 C19 C24 C27 C32 C40 = rcl:CPOL-EU: POLARIZED CAPACITOR, European symbol; MOUSER: 581-TAJD476M016RNJV; SPICEPREFIX: C
C33-C36 = rcl:CPOL-EU: POLARIZED CAPACITOR, European symbol; SPICEPREFIX: C
IC1 = 68komputer:MC68000FN: 68000/68010 Processor 68000 User Manual <https://www.nxp.com/docs/en/reference-manual/MC68000UM.pdf> Based on MC68901FN from micro-mc68000.lbr; OC_FARNELL: unknown; OC_NEWARK: unknown
IC2 = 74xx-eu:74*04: Hex INVERTER
IC3 = 74xx-eu:74*154: 4-line to 16-line data SELECTOR/MULTIPLEXER
IC4 IC6 = 74xx-eu:74*30: 8-input NAND gate
IC5 = 74xx-eu:74*148: 10-line to 4-line and 8-line to 3-line PRIORITY ENCODER
IC7 = 74xx-eu:74*14: Hex schmitt trigger INVERTER
IC8-IC11 = 68komputer:CY62128B: 1-Mbit (128K x 8) Static RAM Datasheet <https://www.westfloridacomponents.com/mm5/graphics/H02/CY62128BLL-55SCT.pdf>
IC12 IC13 = 68komputer:SST39SF0X0: 1 Mbit / 2 Mbit / 4 Mbit Multi-Purpose Flash Datasheet <http://ww1.microchip.com/downloads/en/DeviceDoc/20005022C.pdf>; MOUSER: 804-39SF020A7CPHE
IC14 = 68komputer:MC68681: MC68681 Dual UART Datasheet <https://www.nxp.com/docs/en/data-sheet/SCC68681.pdf>
IC15 = 68komputer:DS1244: 256k NV SRAM with Phantom Clock Datasheet <https://datasheets.maximintegrated.com/en/ds/DS1244-DS1244P.pdf>; MOUSER: 700-DS1244Y-70
IC16 = maxim:MAX232: RS232 TRANSCEIVER; MF: MAXIM; MPN: MAX232ACPE+; OC_FARNELL: 9723773; OC_NEWARK: 68K4544
IC17 = 74xx-eu:74*00: Quad 2-input NAND gate
LED1 = led:LED: LED OSRAM: - CHIPLED LG R971, LG N971, LY N971, LG Q971, LY Q971, LO R971, LY R971 LH N974, LH R974 LS Q976, LO Q976, LY Q976 LO Q996 - Hyper CHIPLED LW Q18S LB Q993, LB Q99A, LB R99A - SideLED LS A670, LO A670, LY A670, LG A670, LP A670 LB A673, LV A673, LT A673, LW A673 LH A674 LY A675 LS A676, LA A676, LO A676, LY A676, LW A676 LS A679, LY A679, LG A679 - Hyper Micro SIDELED® LS Y876, LA Y876, LO Y876, LY Y876 LT Y87S - SmartLED LW L88C, LW L88S LB L89C, LB L89S, LG L890 LS L89K, LO L89K, LY L89K LS L896, LA L896, LO L896, LY L896 - TOPLED LS T670, LO T670, LY T670, LG T670, LP T670 LSG T670, LSP T670, LSY T670, LOP T670, LYG T670 LG T671, LOG T671, LSG T671 LB T673, LV T673, LT T673, LW T673 LH T674 LS T676, LA T676, LO T676, LY T676, LB T676, LH T676, LSB T676, LW T676 LB T67C, LV T67C, LT T67C, LS T67K, LO T67K, LY T67K, LW E67C LS E67B, LA E67B, LO E67B, LY E67B, LB E67C, LV E67C, LT E67C LW T67C LS T679, LY T679, LG T679 LS T770, LO T770, LY T770, LG T770, LP T770 LB T773, LV T773, LT T773, LW T773 LH T774 LS E675, LA E675, LY E675, LS T675 LS T776, LA T776, LO T776, LY T776, LB T776 LHGB T686 LT T68C, LB T68C - Hyper Mini TOPLED® LB M676 - Mini TOPLED Santana® LG M470 LS M47K, LO M47K, LY M47K Source: http://www.osram.convergy.de LUXEON: - LUMILED® LXK2-PW12-R00, LXK2-PW12-S00, LXK2-PW14-U00, LXK2-PW14-V00 LXK2-PM12-R00, LXK2-PM12-S00, LXK2-PM14-U00 LXK2-PE12-Q00, LXK2-PE12-R00, LXK2-PE12-S00, LXK2-PE14-T00, LXK2-PE14-U00 LXK2-PB12-K00, LXK2-PB12-L00, LXK2-PB12-M00, LXK2-PB14-N00, LXK2-PB14-P00, LXK2-PB14-Q00 LXK2-PR12-L00, LXK2-PR12-M00, LXK2-PR14-Q00, LXK2-PR14-R00 LXK2-PD12-Q00, LXK2-PD12-R00, LXK2-PD12-S00 LXK2-PH12-R00, LXK2-PH12-S00 LXK2-PL12-P00, LXK2-PL12-Q00, LXK2-PL12-R00 Source: www.luxeon.com KINGBRIGHT: KA-3528ASYC Source: www.kingbright.com; MOUSER: 604-APTR3216SGC
LED2 LED3 = led:LED: LED OSRAM: - CHIPLED LG R971, LG N971, LY N971, LG Q971, LY Q971, LO R971, LY R971 LH N974, LH R974 LS Q976, LO Q976, LY Q976 LO Q996 - Hyper CHIPLED LW Q18S LB Q993, LB Q99A, LB R99A - SideLED LS A670, LO A670, LY A670, LG A670, LP A670 LB A673, LV A673, LT A673, LW A673 LH A674 LY A675 LS A676, LA A676, LO A676, LY A676, LW A676 LS A679, LY A679, LG A679 - Hyper Micro SIDELED® LS Y876, LA Y876, LO Y876, LY Y876 LT Y87S - SmartLED LW L88C, LW L88S LB L89C, LB L89S, LG L890 LS L89K, LO L89K, LY L89K LS L896, LA L896, LO L896, LY L896 - TOPLED LS T670, LO T670, LY T670, LG T670, LP T670 LSG T670, LSP T670, LSY T670, LOP T670, LYG T670 LG T671, LOG T671, LSG T671 LB T673, LV T673, LT T673, LW T673 LH T674 LS T676, LA T676, LO T676, LY T676, LB T676, LH T676, LSB T676, LW T676 LB T67C, LV T67C, LT T67C, LS T67K, LO T67K, LY T67K, LW E67C LS E67B, LA E67B, LO E67B, LY E67B, LB E67C, LV E67C, LT E67C LW T67C LS T679, LY T679, LG T679 LS T770, LO T770, LY T770, LG T770, LP T770 LB T773, LV T773, LT T773, LW T773 LH T774 LS E675, LA E675, LY E675, LS T675 LS T776, LA T776, LO T776, LY T776, LB T776 LHGB T686 LT T68C, LB T68C - Hyper Mini TOPLED® LB M676 - Mini TOPLED Santana® LG M470 LS M47K, LO M47K, LY M47K Source: http://www.osram.convergy.de LUXEON: - LUMILED® LXK2-PW12-R00, LXK2-PW12-S00, LXK2-PW14-U00, LXK2-PW14-V00 LXK2-PM12-R00, LXK2-PM12-S00, LXK2-PM14-U00 LXK2-PE12-Q00, LXK2-PE12-R00, LXK2-PE12-S00, LXK2-PE14-T00, LXK2-PE14-U00 LXK2-PB12-K00, LXK2-PB12-L00, LXK2-PB12-M00, LXK2-PB14-N00, LXK2-PB14-P00, LXK2-PB14-Q00 LXK2-PR12-L00, LXK2-PR12-M00, LXK2-PR14-Q00, LXK2-PR14-R00 LXK2-PD12-Q00, LXK2-PD12-R00, LXK2-PD12-S00 LXK2-PH12-R00, LXK2-PH12-S00 LXK2-PL12-P00, LXK2-PL12-Q00, LXK2-PL12-R00 Source: www.luxeon.com KINGBRIGHT: KA-3528ASYC Source: www.kingbright.com; MOUSER: 710-156120RS75300
LED4-LED10 = led:LED: LED OSRAM: - CHIPLED LG R971, LG N971, LY N971, LG Q971, LY Q971, LO R971, LY R971 LH N974, LH R974 LS Q976, LO Q976, LY Q976 LO Q996 - Hyper CHIPLED LW Q18S LB Q993, LB Q99A, LB R99A - SideLED LS A670, LO A670, LY A670, LG A670, LP A670 LB A673, LV A673, LT A673, LW A673 LH A674 LY A675 LS A676, LA A676, LO A676, LY A676, LW A676 LS A679, LY A679, LG A679 - Hyper Micro SIDELED® LS Y876, LA Y876, LO Y876, LY Y876 LT Y87S - SmartLED LW L88C, LW L88S LB L89C, LB L89S, LG L890 LS L89K, LO L89K, LY L89K LS L896, LA L896, LO L896, LY L896 - TOPLED LS T670, LO T670, LY T670, LG T670, LP T670 LSG T670, LSP T670, LSY T670, LOP T670, LYG T670 LG T671, LOG T671, LSG T671 LB T673, LV T673, LT T673, LW T673 LH T674 LS T676, LA T676, LO T676, LY T676, LB T676, LH T676, LSB T676, LW T676 LB T67C, LV T67C, LT T67C, LS T67K, LO T67K, LY T67K, LW E67C LS E67B, LA E67B, LO E67B, LY E67B, LB E67C, LV E67C, LT E67C LW T67C LS T679, LY T679, LG T679 LS T770, LO T770, LY T770, LG T770, LP T770 LB T773, LV T773, LT T773, LW T773 LH T774 LS E675, LA E675, LY E675, LS T675 LS T776, LA T776, LO T776, LY T776, LB T776 LHGB T686 LT T68C, LB T68C - Hyper Mini TOPLED® LB M676 - Mini TOPLED Santana® LG M470 LS M47K, LO M47K, LY M47K Source: http://www.osram.convergy.de LUXEON: - LUMILED® LXK2-PW12-R00, LXK2-PW12-S00, LXK2-PW14-U00, LXK2-PW14-V00 LXK2-PM12-R00, LXK2-PM12-S00, LXK2-PM14-U00 LXK2-PE12-Q00, LXK2-PE12-R00, LXK2-PE12-S00, LXK2-PE14-T00, LXK2-PE14-U00 LXK2-PB12-K00, LXK2-PB12-L00, LXK2-PB12-M00, LXK2-PB14-N00, LXK2-PB14-P00, LXK2-PB14-Q00 LXK2-PR12-L00, LXK2-PR12-M00, LXK2-PR14-Q00, LXK2-PR14-R00 LXK2-PD12-Q00, LXK2-PD12-R00, LXK2-PD12-S00 LXK2-PH12-R00, LXK2-PH12-S00 LXK2-PL12-P00, LXK2-PL12-Q00, LXK2-PL12-R00 Source: www.luxeon.com KINGBRIGHT: KA-3528ASYC Source: www.kingbright.com; MOUSER: 710-156120YS75300
Q1 = crystal:CRYSTAL: CRYSTAL; OC_FARNELL: 1667008; OC_NEWARK: unknown
QG1 = crystal:XO-: CRYSTAL; OC_FARNELL: unknown; OC_NEWARK: unknown
R1-R20 = rcl:R-EU_: RESISTOR, European symbol; MOUSER: 652-CR0805-FX6800GLF; SPICEPREFIX: R
S1 S2 = switch-omron:10-XX: OMRON SWITCH; MPN: B3F-1000; OC_FARNELL: 176432; OC_NEWARK: 36M3542
SV1 = 68komputer:1792863: PCB terminal block - PTS 1,5/ 2-5,0-H - 1792863 Footprint Proven Information <https://www.phoenixcontact.com/online/portal/us?uri=pxc-oc-itemdetail:pid=1792863&library=usen&tab=1>; MOUSER: 651-1792863
X1 = con-vg:FABC96R: CONNECTOR female, 96 pins, type R, rows ABC, grid 2.54 mm
X2 X3 = con-subd:F09HP: SUB-D; OC_FARNELL: unknown; OC_NEWARK: unknown